# Altium schematic sheet Sine_Wave_Generator.SchDoc
size A; SheetNumber: 4; SheetTotal: 4
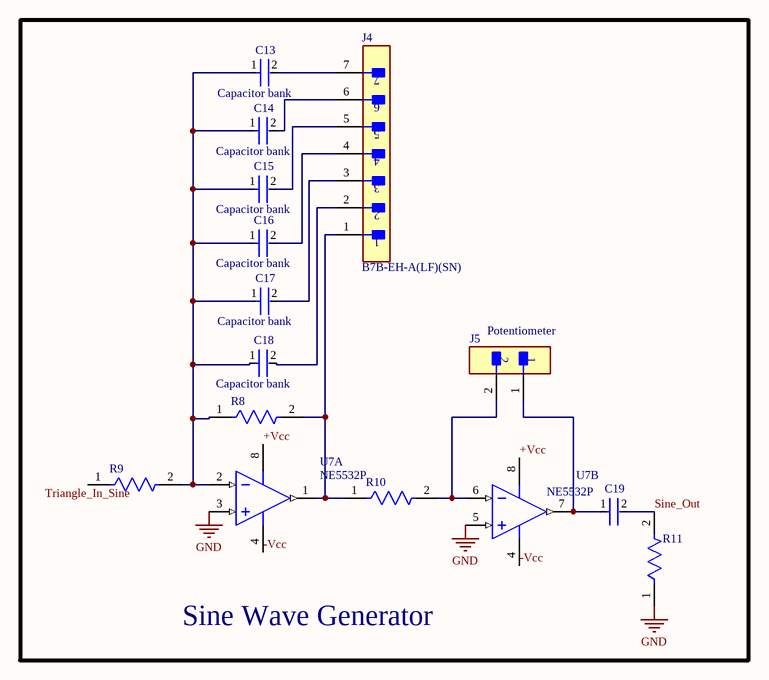
[diagram p0: Sine_Wave_Generator.SchDoc]

## Parts
C13  Capacitor bank  [FP-F471K33Y5RP6UK5R-MFG]
C14  Capacitor bank  [FP-F471K33Y5RP6UK5R-MFG]
C15  Capacitor bank  [FP-F471K33Y5RP6UK5R-MFG]
C16  Capacitor bank  [FP-F471K33Y5RP6UK5R-MFG]
C17  Capacitor bank  [FP-F471K33Y5RP6UK5R-MFG]
C18  Capacitor bank  [FP-F471K33Y5RP6UK5R-MFG]
C19  (no value)  [FP-F471K33Y5RP6UK5R-MFG]
J4  B7B-EH-A(LF)(SN)  [FP-B7B-EH-A_LF_SN-MFG]
J5  Potentiometer  [FP-B2B-XH-A_LF_SN-MFG]
R8  (no value)  [FP-VR37-MFG]
R9  (no value)  [FP-VR37-MFG]
R10  (no value)  [FP-VR37-MFG]
R11  (no value)  [FP-VR37-MFG]
U7  NE5532P  [P0008A]  (parts A,B of 2)

## Blocks framed on the sheet
Sine Wave Generator: C13-C19 J4 J5 R8-R11 U7

## Nets
GND: R11.1 U7.3(IN1+) U7.5(IN2+)
+Vcc: U7.8(VCC+)
-Vcc: U7.4(VCC-)
Sine_Out: C19.2 R11.2
Triangle_In_Sine: R9.1
NetC13_1: C13.1 C14.1 C15.1 C16.1 C17.1 C18.1 R8.1 R9.2 U7.2(IN1-)
NetC13_2: C13.2 J4.7
NetC14_2: C14.2 J4.6
NetC15_2: C15.2 J4.5
NetC16_2: C16.2 J4.4
NetC17_2: C17.2 J4.3
NetC18_2: C18.2 J4.2
NetC19_1: C19.1 J5.1 U7.7(OUT2)
NetJ4_1: J4.1 R8.2 R10.1 U7.1(OUT1)
NetJ5_2: J5.2 R10.2 U7.6(IN2-)

## Library data of the parts
C13-C19 = CMP-02417-000080-1: CAP CER 470PF 2KV Y5R RADIAL; Tolerance: 10%; Dielectric Material: Ceramic; Insulation Resistance: 10GR; Lead/Base Style: Kinked; Lead Diameter: 0.8mm; Series: F; Depth: 5mm; Package Quantity: 1500; Resistor Type: Ceramic; Construction: RADIAL; Min Operating Temperature: -30°C; Mount: Through Hole; Radiation Hardening: No; Voltage: 2kV; Voltage Rating: 2kV; Max Operating Temperature: 125°C; Termination: Radial; RoHS Compliant: Yes; Lead Pitch: 5mm; Capacitance: 470pF; Packaging: Tape and Reel; Length: 8.5mm; Case/Package: Radial; Dielectric: Y5R
J4 = CMP-17439-000532-1: CONN HEADER VERT 7POS 2.5MM; Number of Contacts: 7; Mated Stacking Heights: 8.1mm; Gender: Male; Current Rating: 3A; Voltage Rating: 250V; Termination: Solder; Contact Material: Brass; Connector Type: Header; Flammability Rating: UL94 V-0; Housing Material: Nylon; Series: EH; Fastening Type: Friction; Lead Free: Lead Free; Insulation Color: Natural; Contact Type: Male Pin; Number of Rows: 1; Packaging: Bulk; Color: Natural; Contact Finish - Mating: TIN; Orientation: Straight; Contact Shape: Square; Contact Plating: Tin; Insulation Material: Nylon; Housing Color: White; Mount: Through Hole; Contact Mating Length: 0.13inch; Pitch: 2.5mm; Number of Positions: 7
J5 = CMP-2000-05888-3: CONN HEADER VERT 2POS 2.5MM; Current Rating: 3A; Voltage Rating: 250V; Number of Contacts: 2; Contact Resistance: 20mR; Wire/Cable Gauge: 22AWG; Insulation Resistance: 1GR; Connector Type: Male Pin; Packaging: Bulk; Contact Material: Brass; Lead Free: Lead Free; Orientation: Straight; Contact Plating: Tin; Max Current Rating: 3A; Termination: Solder; Fastening Type: Detent; Depth: 5.75mm; Housing Material: Polyamide; REACH SVHC: No SVHC; Series: XH; Voltage Rating (AC): 250V; Number of Positions: 2; Color: Natural; Contact Type: Male Pin; Max Voltage Rating (DC): 250V; Pitch: 2.5mm; Lead Pitch: 2.5mm; Mount: Through Hole; Max Operating Temperature: 85°C; Length: 7.4mm; Max Voltage Rating (AC): 250V; Min Operating Temperature: -25°C; Number of Rows: 1; Housing Color: White
R8-R11 = CMP-02408-000054-1: RES 1.2M OHM 5% 1/2W AXIAL; Voltage Rating: 3.5kV; Power Rating: 500mW; Temperature Coefficient: 200ppm/°C; Resistance: 1.2MR; Diameter: 4mm; Max Operating Temperature: 155°C; Military Standard: Not; Reach SVHC Compliant: Yes; Min Operating Temperature: -55°C; Resistance Tolerance: 5%; Resistor Type: Metal Film; Tolerance: 5%; Mount: Through Hole; Construction: Cylindrical; Contact Plating: Tin; Length: 10mm; Termination: Axial; Voltage Rating (DC): 3.5kV; Packaging: Ammo Pack; Radiation Hardening: No; Case/Package: Conformal
U7 = CMP-0017-00910-2: Dual Low-Noise High-Speed Audio Operational Amplifier, 10 to 30 V, 0 to 70 degC, 8-pin DIP (P8), Pb-Free (RoHS); Manufacturer: Texas Instruments; Iq per channel(Max)(mA): 4; Slew Rate(Typ)(V/us): 9; Vn at 1kHz(Typ)(nV/rtHz): 5; IIB(Max)(pA): 800000; Total Supply Voltage(Max)(+5V is 5, +/-5V is 10): 30; GBW(Typ)(MHz): 10; CMRR(Min)(dB): 70; Number of Channels: 2; Sub Family: General Purpose Amplifier, High Supply Voltage Amplifier (>=30V), Low Noise Amp (<=10nV/rtHz); ComponentLink2URL: http://www.ti.com/lit/ds/symlink/ne5532.pdf; PackageReference: P0008A; PackageDescription: 8-Pin Plastic In-Line, Body 9.59 x 6.35 mm, Pitch 2.54 mm; ComponentLink1Description: Manufacturer URL; Eco-Plan: Pb-Free (RoHS); Mounting Technology: Through Hole; Code_JEDEC: MS-001; PackageVersion: 4040082/E, 04/2010; DatasheetVersion: SLOS075I; ComponentLink3URL: http://www.ti.com/litv/pdf/mpdi001b; ComponentLink2Description: Datasheet; Vio (25C)(Max)(mV): 4; PartNumber: NE5532P; ComponentLink3Description: Package Specification; Total Supply Voltage(Min)(+5V is 5, +/-5V is 10): 10; ComponentLink1URL: http://www.ti.com/